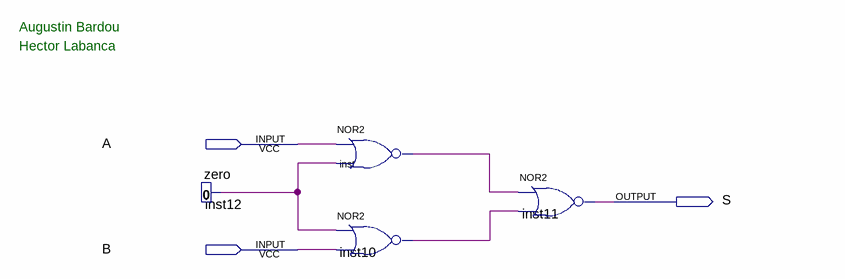
[diagram p0: schematic sheet]
// Quartus schematic etLogique.bdf as structural Verilog: 4 symbols, 3 pins
module etLogique (
  input  A,
  input  B,
  output S
);

  wire inst10_out, inst12_0, inst_out;

  zero inst12 (.\0 (inst12_0));
  nor inst (inst_out, A, inst12_0);
  nor inst10 (inst10_out, inst12_0, B);
  nor inst11 (S, inst_out, inst10_out);

  // Notes on the sheet:
  //   Augustin Bardou
  //   Hector Labanca
endmodule
